# EAGLE design MINI_SAM_D51_005 (EAGLE 9.1.1)
BUILD: 2018/01; DESIGNER: BENJAMIN SHOCKLEY; REV: A
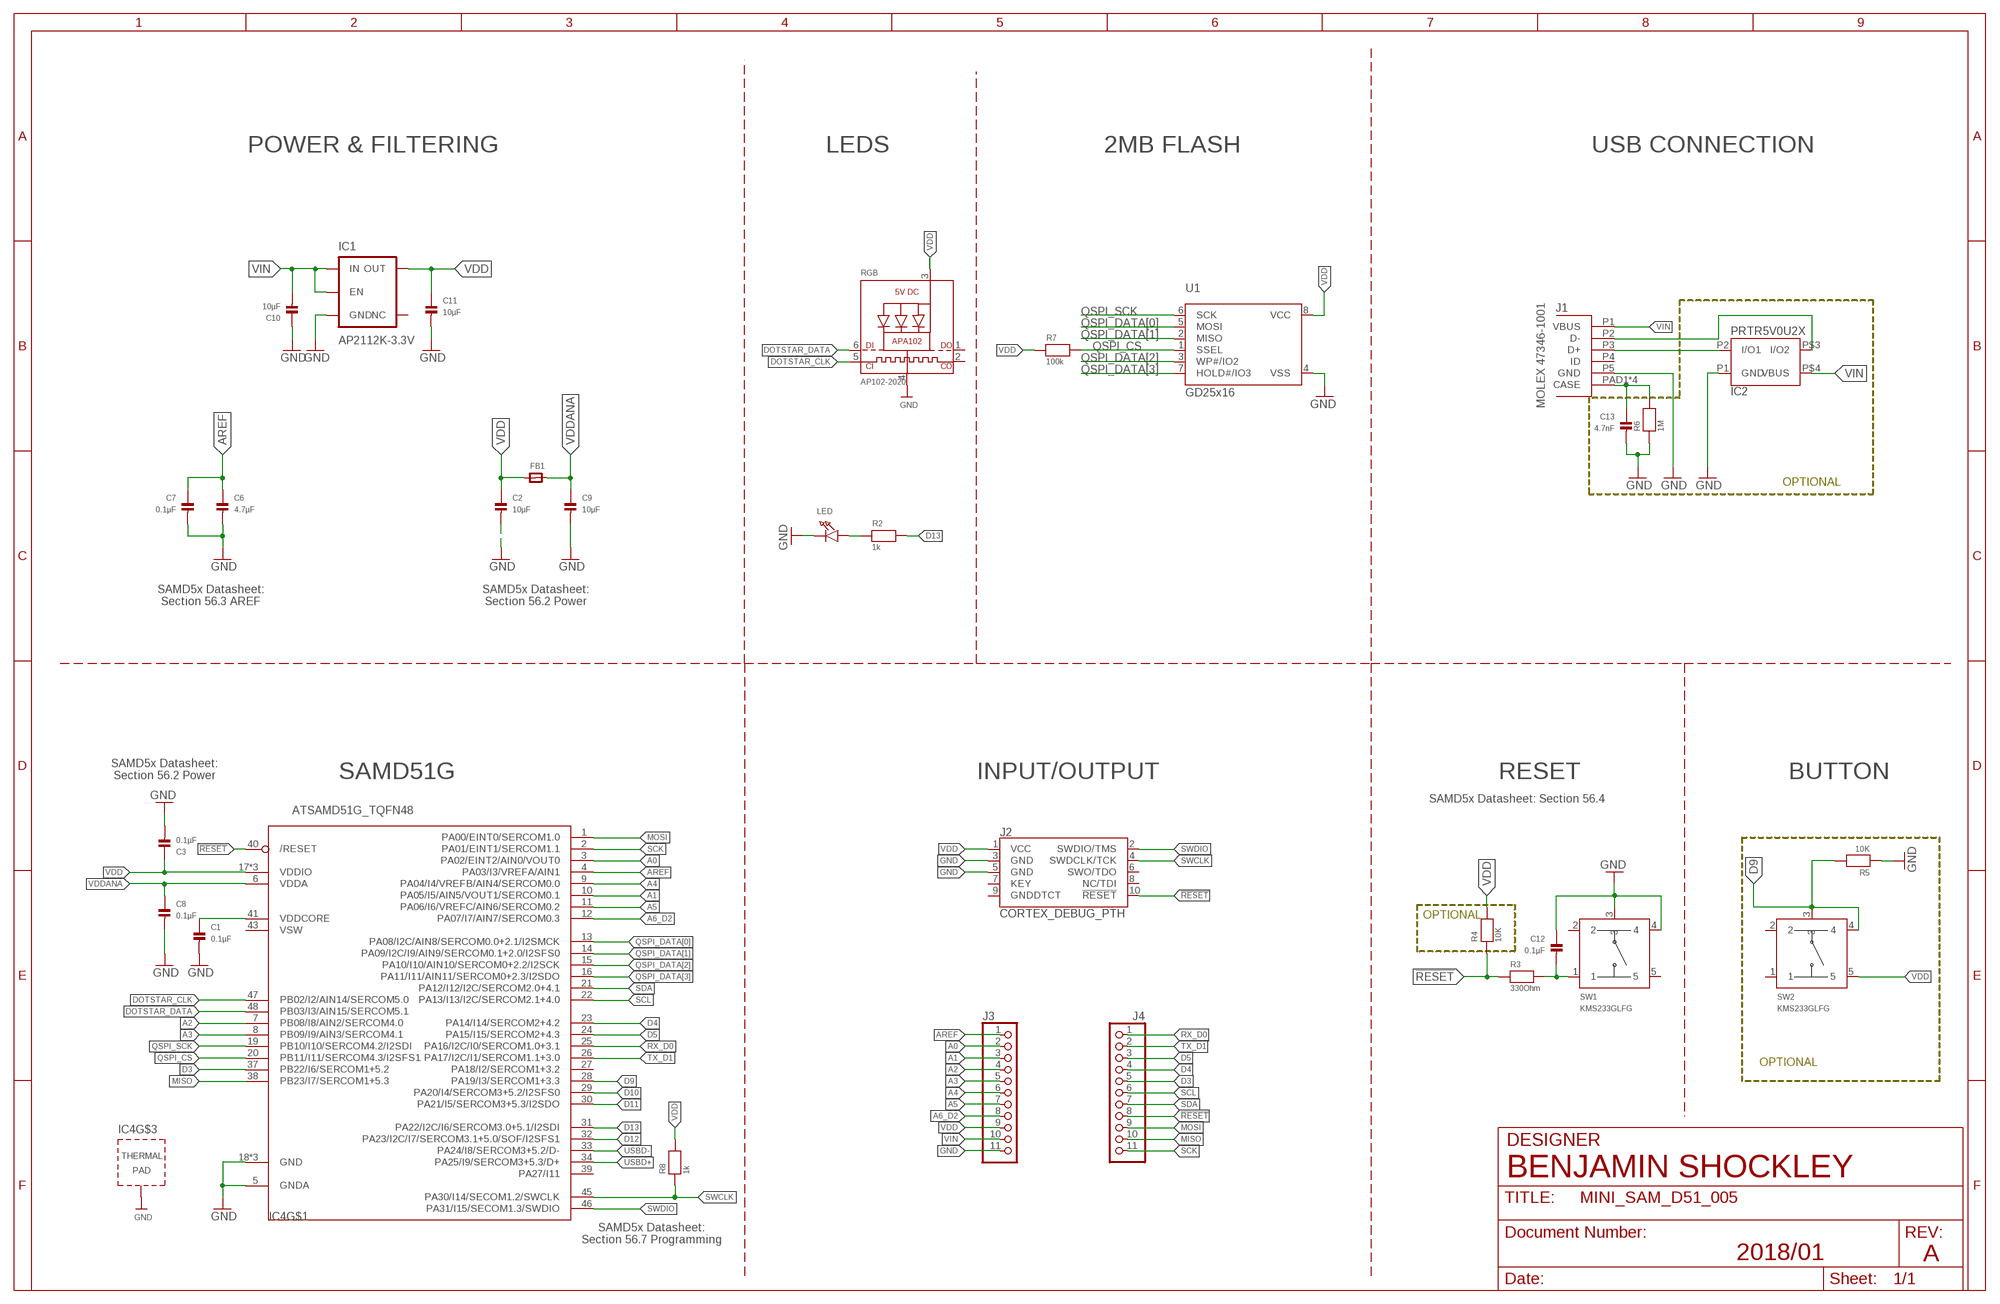
[diagram p0: schematic, sheet 1]

## Parts
C1  0.1µF  CAP_CERAMIC_0603MP  [_0603MP]
C2  10µF  CAP_CERAMIC_0603MP  [_0603MP]
C3  0.1µF  CAP_CERAMIC_0603MP  [_0603MP]
C6  4.7µF  CAP_CERAMIC_0603MP  [_0603MP]
C7  0.1µF  CAP_CERAMIC_0603MP  [_0603MP]
C8  0.1µF  CAP_CERAMIC_0603MP  [_0603MP]
C9  10µF  CAP_CERAMIC_0603MP  [_0603MP]
C10  10µF  CAP_CERAMIC_0603MP  [_0603MP]
C11  10µF  CAP_CERAMIC_0603MP  [_0603MP]
C12  0.1µF  CAP_CERAMIC_0603MP  [_0603MP]
C13  4.7nF  CAP_CERAMIC_0603MP  [_0603MP]
FB1  FERRITE_0603MP  [_0603MP]
IC1  AP2112K-3.3V  V_REG_AP2112K-3.3V  [SOT23-5]
IC2  PRTR5V0U2X  [SOT143B_REFLOW]
IC4  ATSAMD51G_TQFN48  [TQFN48_7MM]
J1  MOLEX_47346-100147346  [MOLEX_47346-1001]
J2  CORTEX_DEBUG_PTH  [2X5-PTH-1.27MM]
J3  PINHD-1X111X11_SMT  [1X11_SMT]
J4  PINHD-1X111X11_SMT  [1X11_SMT]
LED  LED0603_NOOUTLINE  [CHIPLED_0603_NOOUTLINE]
R2  1k  RESISTOR_0603MP  [_0603MP]
R3  330Ohm  RESISTOR_0603MP  [_0603MP]
R4  10K  RESISTOR_0603MP  [_0603MP]
R5  10K  RESISTOR_0603MP  [_0603MP]
R6  1M  RESISTOR_0603MP  [_0603MP]
R7  100k  RESISTOR_0603MP  [_0603MP]
R8  1k  RESISTOR_0603MP  [_0603MP]
RGB  AP102-2020  APA1022020  [APA102_2020]
SW1  KMS233GLFG  KMS_SWITCHKMS  [KMS_SWITCH]
SW2  KMS233GLFG  KMS_SWITCHKMS  [KMS_SWITCH]
U1  GD25x16  SPIFLASH_8PINUX  [USON8]

## Nets
!RESET: IC4.40(/RESET) J2.10(!RESET) J4.8 R3.1 R4.1
A0: IC4.3(PA02/EINT2/AIN0/VOUT0) J3.2
A1: IC4.10(PA05/I5/AIN5/VOUT1/SERCOM0.1) J3.3
A2: IC4.7(PB08/I8/AIN2/SERCOM4.0) J3.4
A3: IC4.8(PB09/I9/AIN3/SERCOM4.1) J3.5
A4: IC4.9(PA04/I4/VREFB/AIN4/SERCOM0.0) J3.6
A5: IC4.11(PA06/I6/VREFC/AIN6/SERCOM0.2) J3.7
A6_D2: IC4.12(PA07/I7/AIN7/SERCOM0.3) J3.8
AREF: C6.1 C7.1 IC4.4(PA03/I3/VREFA/AIN1) J3.1
D3: IC4.37(PB22/I6/SERCOM1+5.2) J4.5
D4: IC4.23(PA14/I14/SERCOM2+4.2) J4.4
D5: IC4.24(PA15/I15/SERCOM2+4.3) J4.3
D9: IC4.28(PA19/I3/SERCOM1+3.3) R5.2 SW2.3 SW2.4
D10: IC4.29(PA20/I4/SERCOM3+5.2/I2SFS0)
D11: IC4.30(PA21/I5/SERCOM3+5.3/I2SDO)
D12: IC4.32(PA23/I2C/I7/SERCOM3.1+5.0/SOF/I2SFS1)
D13: IC4.31(PA22/I2C/I6/SERCOM3.0+5.1/I2SDI) R2.2
DOTSTAR_CLK: IC4.47(PB02/I2/AIN14/SERCOM5.0) RGB.5(CKI)
DOTSTAR_DATA: IC4.48(PB03/I3/AIN15/SERCOM5.1) RGB.6(DI)
GND: C1.2 C2.2 C3.2 C6.2 C7.2 C8.2 C9.2 C10.1 C11.2 C12.1 C13.2 IC1.2(GND) IC2.P1(GND) IC4.5(GNDA) IC4.18(GND) IC4.35(GND) IC4.42(GND) IC4.THERMAL(TP) J1.P5(GND) J2.3(GND) J2.5(GND) J3.11 LED.C R5.1 R6.1 RGB.4(GND) SW1.3 SW1.4 U1.4(VSS)
MISO: IC4.38(PB23/I7/SERCOM1+5.3) J4.10
MOSI: IC4.1(PA00/EINT0/SERCOM1.0) J4.9
N$2: C13.1 J1.PAD1(CASE) J1.PAD2(CASE) J1.PAD3(CASE) J1.PAD4(CASE) R6.2
N$3: LED.A R2.1
N$4: C12.2 R3.2 SW1.1
N$9: C1.1 IC4.41(VDDCORE)
QSPI_CS: IC4.20(PB11/I11/SERCOM4.3/I2SFS1) R7.2 U1.1(SSEL)
QSPI_DATA[0]: IC4.13(PA08/I2C/AIN8/SERCOM0.0+2.1/I2SMCK) U1.5(MOSI)
QSPI_DATA[1]: IC4.14(PA09/I2C/I9/AIN9/SERCOM0.1+2.0/I2SFS0) U1.2(MISO)
QSPI_DATA[2]: IC4.15(PA10/I10/AIN10/SERCOM0+2.2/I2SCK) U1.3(WP#/IO2)
QSPI_DATA[3]: IC4.16(PA11/I11/AIN11/SERCOM0+2.3/I2SDO) U1.7(HOLD#/IO3)
QSPI_SCK: IC4.19(PB10/I10/SERCOM4.2/I2SDI) U1.6(SCK)
RX_D0: IC4.25(PA16/I2C/I0/SERCOM1.0+3.1) J4.1
SCK: IC4.2(PA01/EINT1/SERCOM1.1) J4.11
SCL: IC4.22(PA13/I13/I2C/SERCOM2.1+4.0) J4.6
SDA: IC4.21(PA12/I12/I2C/SERCOM2.0+4.1) J4.7
SWCLK: IC4.45(PA30/I14/SECOM1.2/SWCLK) J2.4(SWDCLK/TCK) R8.1
SWDIO: IC4.46(PA31/I15/SECOM1.3/SWDIO) J2.2(SWDIO/TMS)
TX_D1: IC4.26(PA17/I2C/I1/SERCOM1.1+3.0) J4.2
USBD+ [USB_DATA]: IC2.P2(I/O1) IC4.34(PA25/I9/SERCOM3+5.3/D+) J1.P3(D+)
USBD- [USB_DATA]: IC2.P$3(I/O2) IC4.33(PA24/I8/SERCOM3+5.2/D-) J1.P2(D-)
VDD: C2.1 C3.1 C11.1 FB1.1 IC1.5(OUT) IC4.17(VDDIO) IC4.36(VDDIO) IC4.44(VDDIO) J2.1(VCC) J3.9 R4.2 R7.1 R8.2 RGB.3(VDD) SW2.5 U1.8(VCC)
VDDANA: C8.1 C9.1 FB1.2 IC4.6(VDDA)
VIN: C10.2 IC1.1(IN) IC1.3(EN) IC2.P$4(VBUS) J1.P1(VBUS) J3.10
Unconnected: IC1.4(NC) IC4.27(PA18/I2/SERCOM1+3.2) IC4.39(PA27/I11) J1.P4(ID) J2.6(SWO/TDO) J2.7(KEY) J2.8(NC/TDI) J2.9(GNDDTCT) RGB.1(DO) RGB.2(CKO) SW1.2 SW1.5 SW2.1 SW2.2

## Notes on the sheet
- POWER & FILTERING | LEDS | 2MB FLASH | USB CONNECTION
- MOLEX 47346-1001
- OPTIONAL
- SAMD5x Datasheet:
  Section 56.3 AREF
- SAMD5x Datasheet:
  Section 56.2 Power
- SAMD5x Datasheet:
  Section 56.2 Power
- SAMD51G | INPUT/OUTPUT | RESET | BUTTON
- SAMD5x Datasheet: Section 56.4
- OPTIONAL
- OPTIONAL
- DESIGNER
- SAMD5x Datasheet:
  Section 56.7 Programming

## Power pins joined to a net without a drawn wire
VSW: IC4.43(VSW)

## Library data of the parts
C1-C3 C6-C13 = microbuilder:CAP_CERAMIC: Ceramic Capacitors 0402 - 0402 Surface Mount Capacitors 16pF 50V 5% [Digikey: 445-4899-2-ND] 18pF 50V 5% [Digikey: 490-1281-2-ND] 22pF 50V 5% [Digikey: 490-1283-2-ND] 68pF 50V 5% [Digikey: 490-1289-2-ND] 0.1uF 10V 10% [Digikey: 490-1318-2-ND] 1.0uF 6.3V 10% [Digikey: 490-1320-2-ND] 0603 - 0603 Surface Mount Capacitors 16 pF 50V 5% [Digikey: 445-5051-2-ND] 22 pF 50V [Digikey: PCC220ACVTR-ND] 33 pF 50V 5% [Digikey: 490-1415-1-ND] 56pF 50V 5% [Digikey: 490-1421-1-ND] 220pF 50V 5% [Digikey: 445-1285-1-ND] 680 pF 50V 2200 pF 50V 5% C0G [Digikey: 445-1297-1-ND] 5600 pF 100V 5% X7R [Digikey: 478-3711-1-ND] 0.1 µF 25V 10% [Digikey: PCC2277TR-ND] 0.22 µF 16V 10% X7R [Digikey: 445-1318-1-ND] 1.0 µF 25V 10% [Digikey: 445-5146-2-ND] 0603 - RF Specific 3pF 250V +/-0.1pF RF [Digikey: 712-1347-1-ND] 18 pF 250V 5% [Digikey: 478-3505-1-ND or 712-1322-1-ND] 56 pF 250V 5% C0G RF [Digikey: 490-4867-1-ND] 68 pF 250V RF [Digikey: 490-4868-1-ND] 0805 - 0805 Surface Mount Capacitors 220 pF 250V 2% RF Ceramic Capacitor [Digikey: 712-1398-1-ND] 1000 pF 50V 2% NP0 Ceramic Capacitor [Digikey: 478-3760-1-ND] 0.1 µF 25V 10% Ceramic Capacitor [Digikey: PCC1828TR-ND] 1.0 µF 16V 10% Ceramic Capacitor[Digikey: 490-1691-2-ND] 10.0 µF 10V 10% Ceramic Capacitor[Digikey: 709-1228-1-ND] 10.0 uF 16V 10% Ceramic Capacitor [Digikey: 478-5165-2-ND] 47 uF 6.3V 20% Ceramic Capacitor [Digikey: 587-1779-1-ND or 399-5506-1-ND] 1206 - 1206 Surface Mount Capacitors 47uF 10V 20% Ceramic Capacitor [Digikey: 490-5528-1-ND or 399-5508-1-ND or 445-6010-1-ND] 100uF 6.3V -20%, +80% Y5V Ceramic Capacitor (Digikey: 490-4512-1-ND, Mouser: 81-GRM31CF50J107ZE1L)
FB1 = microbuilder:FERRITE: Ferrite Bead 0603 MMZ1608B121C - 120 Ohm @ 100MHz, 600mA, 0.15 Ohm DC Resistance - Digikey: 445-2164-1-ND BK1608HW121-T - 120 Ohm, 600mA Ferrite Chip - Digikey: 587-1876-2-ND 0805 HZ0805B272R-10 - 2.7K Ohm @ 100MHz, 200mA, 0.8 Ohm DC Resistance - Digikey: 240-2504-1-ND (see also Murata BLM21BD272SN1L) MMZ2012Y152B - 1.5K Ohm @ 100MHz, 500mA, 0.4 Ohm DC Resistance - Digikey: 445-1560-1-ND - Mainly for high frequency (80-400MHz) MMZ2012R102A - 1K Ohm @ 100MHz, 500mA, 0.3 Ohm DC Resistance - Digikey: 445-1555-2-ND - More general purpose (10-200MHz)
IC1 = SparkFun-PowerIC:V_REG_AP2112: AP2112 - 600mA CMOS LDO Regulator w/ Enable The AP2112 is CMOS process low dropout linear regulator with enable function, the regulator delivers a guaranteed 600mA (min.) continuous load current. Features Output Voltage Accuracy: ±1.5% Output Current: 600mA (Min.) Foldback Short Current Protection: 50mA Enable Function to Turn ON/OFF VOUT Low Dropout Voltage (3.3V): 250mV (Typ.) @IOUT=600mA Excellent Load Regulation: 0.2%/A (Typ.) Excellent Line Regulation: 0.02%/V (Typ.) Low Quiescent Current: 55μA (Typ.) Low Standby Current: 0.01μA (Typ.) Low Output Noise: 50μVRMS PSRR: 100Hz -65dB, 1kHz -65dB OTSD Protection Stable with 1.0μF Flexible Cap: Ceramic, Tantalum and Aluminum Electrolytic Operation Temperature Range: -40°C to 85°C ESD: MM 400V, HBM 4000V; PROD_ID: VREG-12457; VALUE: 3.3V
IC2 = Shockley_Custom:PRTR5V0U2X
IC4 = microbuilder:ATSAMD51G
J1 = Shockley_Custom:MOLEX_47346-1001
J2 = SparkFun-Connectors:CORTEX_DEBUG: Cortex Debug Connector - 10 pin Supports JTAG debug, Serial Wire debug, and Serial Wire Viewer. PTH and SMD connector options available. General Connector Information <http://infocenter.arm.com/help/topic/com.arm.doc.faqs/attached/13634/cortex_debug_connectors.pdf> Products: PTH Connector <http://www.digikey.com/product-detail/en/cnc-tech/3220-10-0100-00/1175-1627-ND/3883661> -via Digi-Key SparkFun PSoc <https://www.sparkfun.com/products/13229> SparkFun T <https://www.sparkfun.com/products/13810>
J3 J4 = pinhead+:PINHD-1X11: PIN HEADER
LED = microbuilder:LED: LED 0603 - 0603 Surface Mount Package 2mA: Green LED - Low Power (3.9mcd, 2ma, 1.7Vf) - Digikey: 475-2709-2-ND Orange LED - Low Power (9.8mcd, 2ma, 1.8Vf) - Digikey: 475-1194-2-ND Red LED - Low Power (5mcd, 2ma, 1.8Vf) - Digikey: 475-1195-2-ND Yellow LED - Low Power (7mcd, 2ma, 1.8Vf) - Digikey: 475-1196-2-ND 5mA: Blue LED - Low Power (17mcd, 5ma, 2.9Vf) - Digikey: LNJ937W8CRACT-ND 0805 - 0805 Surface Mount Package 2mA: Red LED (8.8mcd, 2mA, 1.8Vf, Clear) - Low Power [Digikey: 475-2510-1-ND] Green LED (5mcd, 2mA, 1.8Vf, Clear) - Low Power [Digikey: 475-2730-1-ND] Yellow LED (11.3mcd, 2mA, 1.8Vf, Clear) - Low Power [Digikey: 475-2555-1-ND] 20mA: Red LED (104mcd, 20mA, Diffused) - LS R976 [Digikey: 475-1278-6-ND] Red LED (12mcd, 20mA, 2.0Vf, Clear) - APT2012EC [Digikey: 754-1128-1-ND] Green LED (15mcd, 20mA, 2.2Vf, Clear) - APT2012GC [Digikey: 754-1131-1-ND] Orange LED (160mcd, 20mA, 2.1Vf, Clear) - APT2012SECK [Digikey: 754-1130-1-ND] 1206 - 1206 Surface Mount Package Green LED (26mcd, 20mA, Diffused) - LG N971 [Digikey: 475-1407-6-ND] Red LED (15mcd, 20mA, Diffused) - LH N974 [Digikey: 475-1416-6-ND]
R2-R8 = microbuilder:RESISTOR: Resistors 0402 - 0402 Surface Mount Package 22 Ohm 1% 1/16W [Digikey: 311-22.0LRTR-ND] 33 Ohm 5% 1/16W 1.0K 5% 1/16W 1.5K 5% 1/16W 2.0K 1% 1/16W 10.0K 1% 1/16W [Digikey: 311-10.0KLRTR-ND] 10.0K 5% 1/16W [Digikey: RMCF0402JT10K0TR-ND] 12.1K 1% 1/16W [Digikey: 311-22.0LRTR-ND] 100.0K 5% 1/16W 0603 - 0603 Surface Mount Package 0 Ohm 1/10 Watt 1% Resistor 15 Ohm 1/10 Watt 1% Resistor 33 Ohm 1/10 Watt 1% Resistor 49.9 Ohm 1/10 Watt 1% Resistor 100 Ohm 1/10 Watt 1% Resistor 150 Ohm 1/10 Watt 1% Resistor 240 Ohm 1/10 Watt 1% Resistor 390 Ohm 1/10 Watt 1% Resistor 560 Ohm 1/10 Watt 1% Resistor 680 Ohm 1/10 Watt 1% Resistor 750 Ohm 1/10 Watt 1% Resistor 1.0K Ohm 1/10 Watt 1% Resistor 1.5K Ohm 1/10 Watt 1% Resistor 2.0K Ohm 1/10 Watt 1% Resistor 2.2K Ohm 1/10 Watt 1% Resistor 3.3K Ohm 1/10 Watt 1% Resistor 4.7K Ohm 1/10 Watt 1% Resistor 10.0K Ohm 1/10 Watt 1% Resistor 12.0K Ohm 1/10 Watt 1% Resistor 12.1K Ohm 1/10 Watt 1% Resistor 20.0K Ohm 1/10 Watt 1% Resistor 33.0K Ohm 1/10 Watt 1% Resistor 100.0K Ohm 1/10 Watt 1% Resistor 0805 - 0805 Surface Mount Package 0 Ohm 1/8 Watt 1% Resistor 33 Ohm 1/8 Watt 1% Resistor 100 Ohm 1/8 Watt 1% Resistor 150 Ohm 1/8 Watt 1% Resistor 200 Ohm 1/8 Watt 1% Resistor 240 Ohm 1/8 Watt 1% Resistor 330 Ohm 1/8 Watt 1% Resistor 390 Ohm 1/8 Watt 1% Resistor 470 Ohm 1/8 Watt 1% Resistor 1.0K Ohm 1/8 Watt 1% Resistor 1.5K Ohm 1/8 Watt 1% Resistor 2.0K Ohm 1/8 Watt 1% Resistor 4.7K Ohm 1/8 Watt 1% Resistor 5.1K Ohm 1/8 Watt 1% Resistor 5.6K Ohm 1/8 Watt 1% Resistor 10.0K Ohm 1/8 Watt 1% Resistor 22.0K Ohm 1/8 Watt 1% Resistor 33.0K Ohm 1/8 Watt 1% Resistor 100K Ohm 1/8 Watt 1% Resistor 1206 - 1206 Surface Mount Package 2012 - 2010 Surface Mount Package 0.11 Ohm 1/2 Watt 1% Resistor - Digikey: RHM.11UCT-ND
RGB = microbuilder:APA102: APA102/DotStar Pixels VCC: 5V DC Refresh Rate: 400Hz
SW1 SW2 = Shockley_Custom:KMS_SWITCH
U1 = microbuilder:SPIFLASH_8PIN: SOIC8 SPI Flash Be careful with the size since SOIC8 flash comes in several 'widths' SOIC8 150 mil M25P16 - 16Mbit (2Mbit x 8) Serial Flash (75MHz SPI Bus), Supply: 2.7-3.6V Digikey: SOIC8 - M25P16-VMN6P-ND SOIC8 208 mil W25Q16BVSSIG - 16Mbit (2Mbit x 8) Serial Flash (104MHz SPI Bus), Supply: 2.7-3.6V Digikey: SOIC8 - W25Q16BVSSIG-ND

## Board
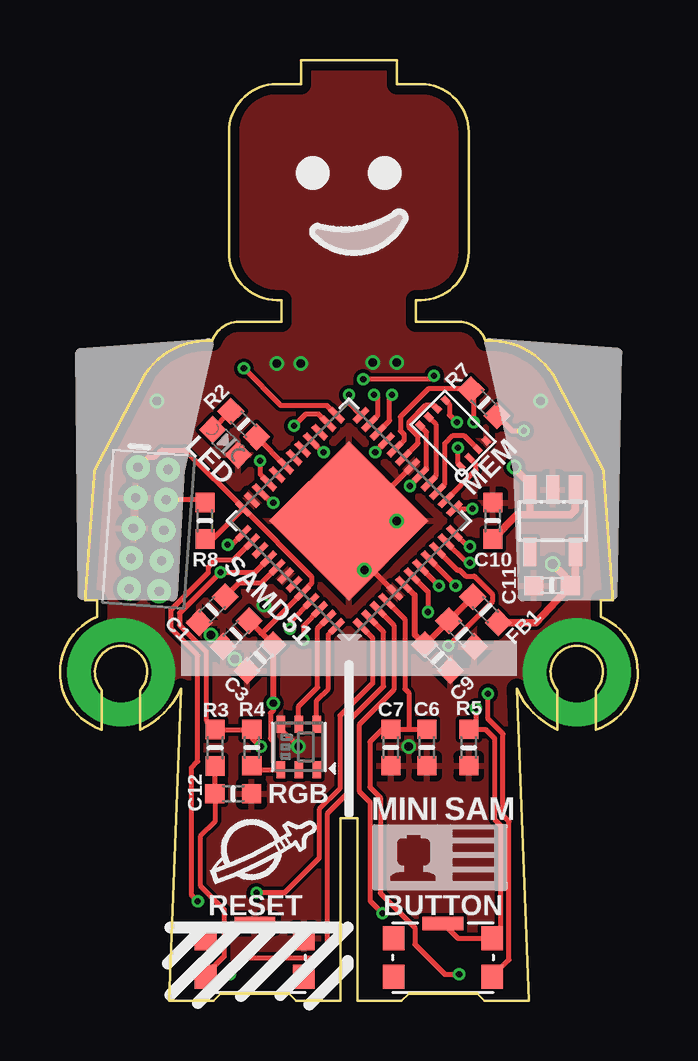
[diagram p1: board, top side]
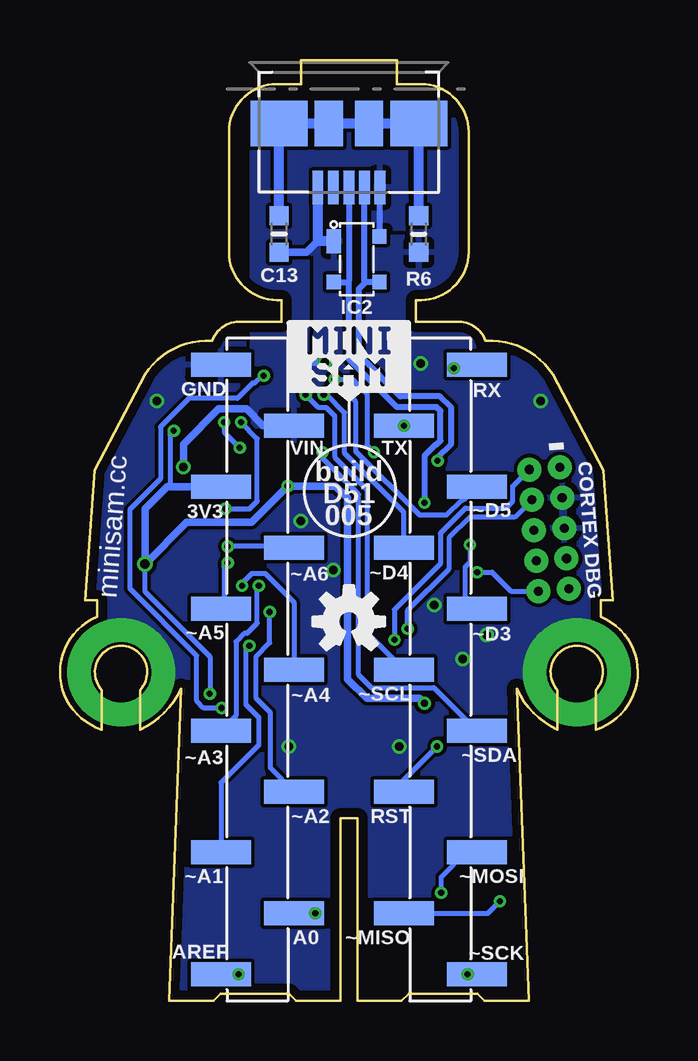
[diagram p2: board, bottom side, seen from below]

Size 24.1 x 39.2 mm. Coordinates in mm from the lower left corner, seen from the top.
Outline: 10.05,39.2 14.05,39.2 14.05,38.2 15.05,38.2 arc-90 17.05,36.2 17.05,31.2 arc-90 15.05,29.2 14.85,29.2 14.85,28.3 16.73,28.3 arc-63 17.75,27.5 arc-60 20.55,26.1 22.65,22.1 23.05,16.7 22.55,16.7 22.55,16 arc-140 22.35,11.3 22.35,12.95 arc132 21.55,14.8 arc132 20.75,12.95 20.75,11.3 arc-40 19.05,13 19.55,0 17.7,0 17.4,0.3 14.55,0.3 14.25,0 12.4,0 12.4,7.6 11.7,7.6 11.7,0 9.85,0 9.55,0.3 6.7,0.3 6.4,0 4.55,0 5.05,13 arc-40 3.35,11.3 3.35,12.95 arc132 2.55,14.8 arc132 1.75,12.95 1.75,11.3 arc-140 1.55,16 1.55,16.7 1.05,16.7 1.45,22.1 3.55,26.1 arc-60 6.35,27.5 arc-63 7.37,28.3 9.25,28.3 9.25,29.2 9.05,29.2 arc-90 7.05,31.2 7.05,36.2 arc-90 9.05,38.2 10.05,38.2 10.05,39.2
Copper layers (1*16): Top 0.035559375mm / dielectric 1.6mm / Bottom 0.035559375mm
Design rules "oshpark-2layer *": minimum track width 6mil, minimum drill 10mil, track to track 6mil, track to pad 6mil, pad to pad 6mil, via to via 6mil, smd to smd 6mil, copper to edge 15mil, drill to drill 6mil, minimum pad ring 5mil, minimum via ring 5mil, stop-mask expansion 2.5mil, vias tented up to drill 15mil, thermal gap 10mil

### Footprints (pad centres in the part's own frame; a part is rotated, then mirrored left to right if it is on the bottom)
_0603MP = smd 0.8 x 0.8: 1 -0.762,0; 2 0.762,0
SOT23-5 = smd 0.55 x 1.2: 1 -0.95,-1.3; 2 0,-1.3; 3 0.95,-1.3; 4 0.95,1.3; 5 -0.95,1.3
SOT143B_REFLOW = smd 1 x 0.6: P1 -0.75,-0.95 | smd 0.6 x 0.6: P2 0.95,-0.95; P$3 0.95,0.95; P$4 -0.95,0.95
TQFN48_7MM = smd 0.25 x 0.75: 1 -2.75,-3.475; 2 -2.25,-3.475; 3 -1.75,-3.475; 4 -1.25,-3.475; 5 -0.75,-3.475; 6 -0.25,-3.475; 7 0.25,-3.475; 8 0.75,-3.475; 9 1.25,-3.475; 10 1.75,-3.475; 11 2.25,-3.475; 12 2.75,-3.475; 25 2.75,3.475; 26 2.25,3.475; 27 1.75,3.475; 28 1.25,3.475; 29 0.75,3.475; 30 0.25,3.475; 31 -0.25,3.475; 32 -0.75,3.475; 33 -1.25,3.475; 34 -1.75,3.475; 35 -2.25,3.475; 36 -2.75,3.475 | smd 0.75 x 0.25: 13 3.475,-2.75; 14 3.475,-2.25; 15 3.475,-1.75; 16 3.475,-1.25; 17 3.475,-0.75; 18 3.475,-0.25; 19 3.475,0.25; 20 3.475,0.75; 21 3.475,1.25; 22 3.475,1.75; 23 3.475,2.25; 24 3.475,2.75; 37 -3.475,2.75; 38 -3.475,2.25; 39 -3.475,1.75; 40 -3.475,1.25; 41 -3.475,0.75; 42 -3.475,0.25; 43 -3.475,-0.25; 44 -3.475,-0.75; 45 -3.475,-1.25; 46 -3.475,-1.75; 47 -3.475,-2.25; 48 -3.475,-2.75 | smd 4.7 x 4.7: THERMAL 0,0
MOLEX_47346-1001 = smd 0.45 x 1.38: P1 1.3,-2.66; P2 0.65,-2.66; P3 0,-2.66; P4 -0.65,-2.66; P5 -1.3,-2.66 | smd 2.375 x 1.9: PAD1 -2.913,0; PAD4 2.913,0 | smd 1.175 x 1.9: PAD2 -0.838,0; PAD3 0.838,0
2X5-PTH-1.27MM = drill 0.381 pad 1: 1 -2.54,-0.635; 2 -2.54,0.635; 3 -1.27,-0.635; 4 -1.27,0.635; 5 0,-0.635; 6 0,0.635; 7 1.27,-0.635; 8 1.27,0.635; 9 2.54,-0.635; 10 2.54,0.635
1X11_SMT = smd 1 x 2.5: 1 -12.7,1.52; 2 -10.16,-1.52; 3 -7.62,1.52; 4 -5.08,-1.52; 5 -2.54,1.52; 6 0,-1.52; 7 2.54,1.52; 8 5.08,-1.52; 9 7.62,1.52; 10 10.16,-1.52; 11 12.7,1.52
CHIPLED_0603_NOOUTLINE = smd 0.8 x 0.8: A 0,-0.75; C 0,0.75
APA102_2020 = smd 0.7 x 0.35: 1 -0.95,-0.75; 2 -0.95,0; 3 -0.95,0.75; 4 0.95,0.75; 5 0.95,0; 6 0.95,-0.75
KMS_SWITCH = smd 0.9 x 1: 1 -2.05,-0.8; 2 -2.05,0.8; 4 2.05,0.8; 5 2.05,-0.8 | smd 1.7 x 0.55: 3 0,1.425
USON8 = smd 0.35 x 0.25: 1 -1.2,0.75; 2 -1.2,0.25; 3 -1.2,-0.25; 4 -1.2,-0.75; 5 1.2,-0.75; 6 1.2,-0.25; 7 1.2,0.25; 8 1.2,0.75

### Placement (x,y rotation side)
C1  6.35,16.3 225 top
C2  7.35,15.3 225 top
C3  8.35,14.3 225 top
C6  15.3,10.55 270 top
C7  13.8,10.55 270 top
C8  16.75,15.3 315 top
C9  15.75,14.3 315 top
C10  18.05,20 270 top
C11  20.52,17.3 180 top
C12  7.22,8.62 180 top
C13  14.96,31.95 270 bottom
FB1  17.75,16.3 135 top
IC1  20.55,20 180 top
IC2  11.72,30.9 270 bottom
IC4  12.05,20 45 top
J1  12.05,36.55 0 bottom
J2  3.7,19.65 265.8 top
J3  15.86,13.8 90 bottom
J4  8.24,13.8 270 bottom
LED  6.9,23.27 225 top
R2  7.66,24.03 315 top
R3  6.47,10.54 270 top
R4  8,10.55 270 top
R5  17.05,10.55 90 top
R6  9.14,31.95 90 bottom
R7  17.68,24.91 135 top
R8  6.05,20 270 top
RGB  9.96,10.58 90 top
SW1  8.12,1.8 0 top
SW2  15.97,1.8 0 top
U1  16.4,23.65 135 top
U$3  [OSHW-LOGO-S]  12.05,15.8 0 bottom

### Tracks (layer width: path | path; a pad name or v marks a point on that pad's centre or on a via)
!RESET  (via drill 0.25)
  Top 0.203: IC4.40 8.14,17.86 v6.7,17.86 4.99,16.15 4.99,15.66 6.1,14.54 6.1,11.67 R3.1 R4.1 8,10.97 v8.37,10.59
  Bottom 0.203: v6.7,17.86 6.08,17.86 5.29,17.07 J2.10 | v8.37,10.59 9.76,9.21 J4.8
A0  (via drill 0.25)
  Top 0.203: IC4.3 13.95,15.62 13.95,12.98 12.5,11.53 12.5,8.7 12.95,8.25 12.95,4.15 v13.45,3.65
  Bottom 0.203: v13.45,3.65 J3.2
A1  (via drill 0.25)
  Top 0.203: v16.2,14.8 18.03,16.63 18.03,16.94 17.28,17.69 16.93,17.69 16.68,17.95 16.57,17.95 IC4.10
  Bottom 0.203: J3.3 17.38,9.09 15.8,10.66 15.8,11.8 16.35,12.35 16.35,14.65 v16.2,14.8
A2  (via drill 0.25)
  Top 0.203: IC4.7 15.35,17.05 v15.35,16.2
  Bottom 0.203: v15.35,16.2 15.35,14.91 15.92,14.35 15.92,12.61 15.32,12.01 15.32,9.7 J3.4
A3  (via drill 0.25)
  Top 0.203: v15.81,17.29 IC4.8
  Bottom 0.203: J3.5 16.75,11.88 16.75,14.96 16.41,15.31 16.3,15.31 15.87,15.73 15.87,17.22 15.85,17.25 v15.81,17.29
A4  (via drill 0.25)
  Top 0.203: IC4.9 16.5,17.32 v16.5,17.3
  Bottom 0.203: J3.6 14.34,16.61 15.54,17.81 16.09,17.81 16.5,17.4 v16.5,17.3
A5  (via drill 0.25)
  Top 0.203: IC4.11 16.98,18.25 v17.1,18.25
  Bottom 0.203: J3.7 17.25,16.46 17.25,18.09 v17.1,18.25
A6_D2  (via drill 0.25)
  Top 0.203: IC4.12 17.01,18.93 v17.1,18.93
  Bottom 0.203: v17.1,18.93 14.39,18.93 J3.8
AREF  (via drill 0.25)
  Top 0.203: IC4.4 14.38,15.9 14.38,13 14.55,12.83 14.55,11.31 | v16.65,1.1 16.05,1.1 14.8,2.35 14.8,3.04 13.35,4.49 13.35,8.46 12.92,8.9 12.92,10.78 13.45,11.31 C7.1 14.55,11.31 | 14.55,11.31 C6.1
  Bottom 0.203: J3.1 v16.65,1.1
D3  (via drill 0.25)
  Top 0.203: v7,19 7.16,19 IC4.37
  Bottom 0.203: v7,19 7,18.28 7.21,18.07 7.21,16.83 J4.5
D4  (via drill 0.25)
  Top 0.203: IC4.23 13.25,24.38 13.25,25.13 13.13,25.25 v13.09,25.25
  Bottom 0.203: J4.4 9.76,20.36 12.22,22.82 12.23,22.83 12.23,24.51 12.97,25.25 v13.09,25.25
D5  (via drill 0.25)
  Top 0.203: IC4.24 12.05,24.91 v12.05,25.25
  Bottom 0.203: J4.3 7.25,20.88 7.34,20.88 7.98,20.24 9.11,20.24 11.75,22.89 11.75,24.96 v12.05,25.25
D9  (via drill 0.25)
  Top 0.203: IC4.28 10.97,22.85 v11,22.85 | v15.6,26.05 15.45,25.9 v12.65,25.9 | SW2.3 16.6,2.6 SW2.4 | SW2.4 | v17.35,12.2 17.35,11.61 R5.2 17.75,11.31 18.12,10.94 18.12,8.9 18.12,7.57 18.37,7.32 18.37,2.95 SW2.4
  Bottom 0.203: v15.6,26.05 15.67,26.05 15.97,25.75 16.02,25.75 16.05,25.75 16.7,25.1 18.72,25.1 19.91,23.91 19.91,21.75 21.18,20.48 21.18,17.17 18.39,14.39 18.39,12.5 18.1,12.2 v17.35,12.2 | v11,22.85 11.3,23.15 11.3,25.3 11.9,25.9 v12.65,25.9
D13
  Top 0.203: R2.2 IC4.31
DOTSTAR_CLK
  Top 0.203: IC4.47 10.75,15.52 10.75,13.06 9.96,12.27 RGB.5
DOTSTAR_DATA
  Top 0.203: IC4.48 11.2,15.26 11.2,13.01 10.71,12.52 RGB.6
GND  (via drill 0.35, 2.5 pad 4.5)
  Top 0.203: IC4.5 12.4,18.59 12.4,20 | IC4.18 12.4,20 | 12.4,20 IC4.THERMAL v14.05,20 | RGB.4 9.21,11.34 v9.95,10.6
  Bottom 0.305: C13.2 13.81,31.18 13.35,31.65 | v14.05,26.6 v13.05,26.6
  Bottom 0.406: J1.P5 13.35,31.65 IC2.P1
  other vias: 2.55,13.7 21.55,13.7 6.3,15.25 20.05,25 4.05,25 7.3,14.25 12.7,17.95 9.05,26.55 10.05,26.55 8.5,16.5 14.55,10.6
  pour Top: 4.55,0 19.55,0 19.55,12 21.05,12 21.05,14 22.05,14 22.05,12 24.05,12 24.05,40 0.05,40 0.05,12 2.05,12 2.05,14 3.05,14 3.05,12 4.55,12
  pour Bottom (rank 2): 9.75,40 9.75,32 13.55,32 13.55,27.35 24.05,27.35 24.05,12 19.55,12 19.55,0 4.55,0 4.55,12 3.05,12 3.05,14 2.05,14 2.05,12 0.05,12 0.05,40
MISO  (via drill 0.25)
  Top 0.203: IC4.38 7.23,18.37 6.49,18.37 6.19,18.07 6.19,17.86 4.69,16.36 | v5.75,4.15 5.47,4.42 5.47,9.7 5.75,9.97 5.75,14.39 4.63,15.51 4.63,16.3 | 4.63,16.3 4.69,16.36 | 4.63,16.3 4.69,16.36
  Bottom 0.203: J4.10 6.26,3.64 v5.75,4.15
MOSI  (via drill 0.25)
  Top 0.203: IC4.1 13.05,15.11 13.05,13.25 11.68,11.88 11.68,8.84 10.81,7.98 10.81,5.95 9.36,4.5 v8.2,4.5
  Bottom 0.203: v8.2,4.5 8.2,5.15 7.17,6.18 J4.9
N$2
  Bottom 0.406: R6.2 J1.PAD4 J1.PAD3 J1.PAD2 J1.PAD1 C13.1
N$3
  Top 0.203: LED.A 7.12,24.56 R2.1
N$4
  Top 0.203: SW1.1 6.07,1.08 6.85,1.85 6.85,3.79 5.85,4.8 5.85,6.85 6.46,7.46 C12.2 R3.2
N$9
  Top 0.203: IC4.41 8.39,17.4 7.45,17.4 C1.1
QSPI_CS  (via drill 0.25)
  Top 0.203: R7.2 17.1,25.5 15.36,25.5 14.2,24.33 14.2,23.75 14.35,23.6 14.35,23.35 IC4.20 | R7.2 | v17.25,24.1 17.24,25.35 R7.2 | U1.1 16.6,22.39 v16.6,23.05
  Bottom 0.203: v17.25,24.1 17.25,23.7 v16.6,23.05
QSPI_DATA[0]  (via drill 0.25)
  Top 0.203: U1.5 16.08,25.02 16.23,24.87 16.23,24.42 v16.55,24.1 | IC4.13 16.46,20.5 v17.2,20.5
  Bottom 0.203: v17.2,20.5 16.19,20.5 15.87,20.82 15.87,23.43 v16.55,24.1
QSPI_DATA[1]
  Top 0.203: U1.2 17.35,22.35 17.35,22.12 IC4.14
QSPI_DATA[2]
  Top 0.203: IC4.15 16.05,21.53 16.05,23.22 16.39,23.56 16.84,23.56 U1.3
QSPI_DATA[3]
  Top 0.203: IC4.16 15.69,21.88 15.69,24 U1.7
QSPI_SCK
  Top 0.203: IC4.19 14.93,23.24 14.93,23.52 14.55,23.9 14.55,24.11 15.27,24.83 15.57,24.83 U1.6
RX_D0  (via drill 0.25)
  Top 0.203: IC4.25 11.14,24.8 9.22,24.8 v7.67,26.35
  Bottom 0.203: v7.67,26.35 6.87,26.35 J4.1
SCK  (via drill 0.25)
  Top 0.203: IC4.2 13.5,15.37 13.5,13.1 12.06,11.66 12.06,8.71 11.16,7.82 11.16,2.17 10.8,1.8 7.8,1.8 v7.1,1.1
  Bottom 0.203: J4.11 v7.1,1.1
SCL  (via drill 0.25)
  Top 0.203: IC4.22 13.75,24.18 13.75,25.15 v13.85,25.25
  Bottom 0.203: 12.98,24.71 13.05,24.71 | J4.6 11.29,15.33 11.29,21.3 12.64,22.65 12.64,24.37 12.98,24.71 | 13.05,24.71 12.98,24.71 | 13.05,24.71 13.31,24.71 v13.85,25.25
SDA  (via drill 0.25)
  Top 0.203: v13.15,22.85 13.15,22.87 IC4.21
  Bottom 0.203: 7.19,11.26 J4.7 8.5,13.05 11.11,13.05 11.64,13.57 11.64,21.1 13.15,22.6 v13.15,22.85
SWCLK  (via drill 0.25)
  Top 0.203: IC4.45 9.6,15.78 v9.6,15.5 | R8.1 5.94,20.87 J2.4
  Bottom 0.203: v9.6,15.5 9.6,16.27 7.86,18.01 7.86,19.3 7.01,20.16 5.14,20.16 J2.4
SWDIO  (via drill 0.25)
  Top 0.203: IC4.46 10.15,15.62 v10.15,15.05
  Bottom 0.203: 5.5,20.53 7.19,20.53 8.24,19.48 8.24,18.21 10.15,16.3 v10.15,15.05 | J2.2 5.21,21.44 5.21,20.82 5.5,20.53 | 5.5,20.53
TX_D1  (via drill 0.25)
  Top 0.203: IC4.26 10.79,24.44 10.24,24.44 J4.2
  other vias: 9.76,23.96
USBD+  (via drill 0.25)
  Top 0.254: IC4.34 8.82,20.75 v8.9,20.75
  Bottom 0.254: J1.P3 12.05,30 | IC2.P2 12.1,29.95 12.05,30 | v8.9,20.75 8.88,20.77 8.88,22.72 8.42,23.18 8.39,23.18 8.23,23.34 8.23,24.58 8.39,24.74 10.05,24.74 12.05,26.74 12.05,30
USBD-  (via drill 0.25)
  Top 0.203: v8.35,22.5 8.35,21.93 IC4.33
  Bottom 0.254: J1.P2 11.4,30 11.35,29.95 | IC2.P$3 11.35,29.95 | 11.35,29.95 11.63,29.67 11.63,26.91 9.91,25.19 8.24,25.19 7.78,24.73 7.78,23.19 8.35,22.62 v8.35,22.5
VDD  (via drill 0.25, 0.3, 0.4)
  Top 0.203: IC4.36 10.5,17.66 10.5,17.4 10.12,17.02 IC4.44 8.46,15.35 | R8.2 6.33,19.19 IC4.36 | v19.35,23.75 18.85,23.75 R7.1 | IC4.17 15.29,22.18 15.29,23.7 U1.8 | R4.2 8.16,9.63 RGB.3 8.89,9.95 8.89,10.81 8.78,10.92 8.78,11.98 8.9,12.1 v8.9,12.4 | SW2.5 18.73,1.7 18.73,7.47 18.48,7.72 18.48,11.12 17.85,11.75 v17.85,12.8 | 3.51,22.23 J2.1 3.67,22.65 3.95,22.65 4.25,22.95 5.21,22.95 IC4.36 | 8.9,14.83 C3.1
  Top 0.254: IC4.17 14.6,21.49 v14.6,21.45 | 8.4,15.35 8.38,15.35 C2.1 | 8.4,15.35 8.4,15.33 C3.1 | 8.4,15.35 8.46,15.35 | v8.9,12.4 8.9,14.83
  Top 0.305: FB1.1 19.84,15.76 C11.1 | IC1.5 21.5,17.42 C11.1 | v20.55,18.2 21.28,17.47 C11.1
  Bottom 0.203: v20.55,18.2 20.55,17.04 17.84,14.33 v17.84,12.81 v17.85,12.8 | 19.63,21.42 19.5,21.54 19.5,23.59 v19.35,23.75
  Bottom 0.305: 17.4,21.45 J3.9 19.63,21.42 20.55,20.5 v20.55,18.2 18.81,19.94 16.11,19.94 v14.6,21.45 12.6,21.45 12.1,20.95 12.1,16.3 12.1,14.85 12.1,13.4 11.3,12.6 9.1,12.6 v8.9,12.4
VDDANA
  Top 0.254: FB1.2 C8.1 C9.1 14.8,15.25 14.8,16.9 14.79,16.9 IC4.6
VIN  (via drill 0.35)
  Top 0.305: IC1.1 21.5,20.45 21.3,20.25 19.6,20.25 | C10.2 19.06,20.25 19.6,20.25 | 19.6,20.25 IC1.3 19.6,21.55 18.95,22.2 v18.95,22.25
  Bottom 0.254: J1.P1 10.77,33.87 IC2.P$4
  Bottom 0.305: J3.10 15.62,23.96 16.32,24.66 17.48,24.66 18.95,23.19 v18.95,22.25
  pour Bottom: 9.75,40 9.7,32.2 13.8,32.2 13.85,23.35 16.05,23.35 16.05,40

### Text on the board
bPlace: - | CORTEX DBG
tNames: R2 | MEM | SAMD51 | MINI | SAM | RESET | BUTTON
bNames: RX | GND | TX | VIN | ~D5 | build / D51 / 005 | 3V3 | minisam.cc | ~D4 | ~A6 | ~D3 | ~A5 | ~SCL | ~A4 | ~SDA | ~A3 | RST | ~A2 | ~MOSI | ~A1 | ~SCK | ~MISO | A0 | AREF
tStop: - | CORTEX DBG
_tNames: L | L | RGB | RGB | IC1 | IC1 | C1 | C1 | FB1 | FB1 | C10 | C11 | C2 | C2 | C3 | C3 | C8 | C8 | C9 | C9 | C6 | C6 | R5 | R5 | C7 | C7 | R3 | R3 | R4 | R4 | C12 | C12
_bNames: IC2 | IC2 | R6 | R6 | C13 | C13 | JP1 | JP1